# EAGLE design arduino-double (EAGLE 7.3.0)
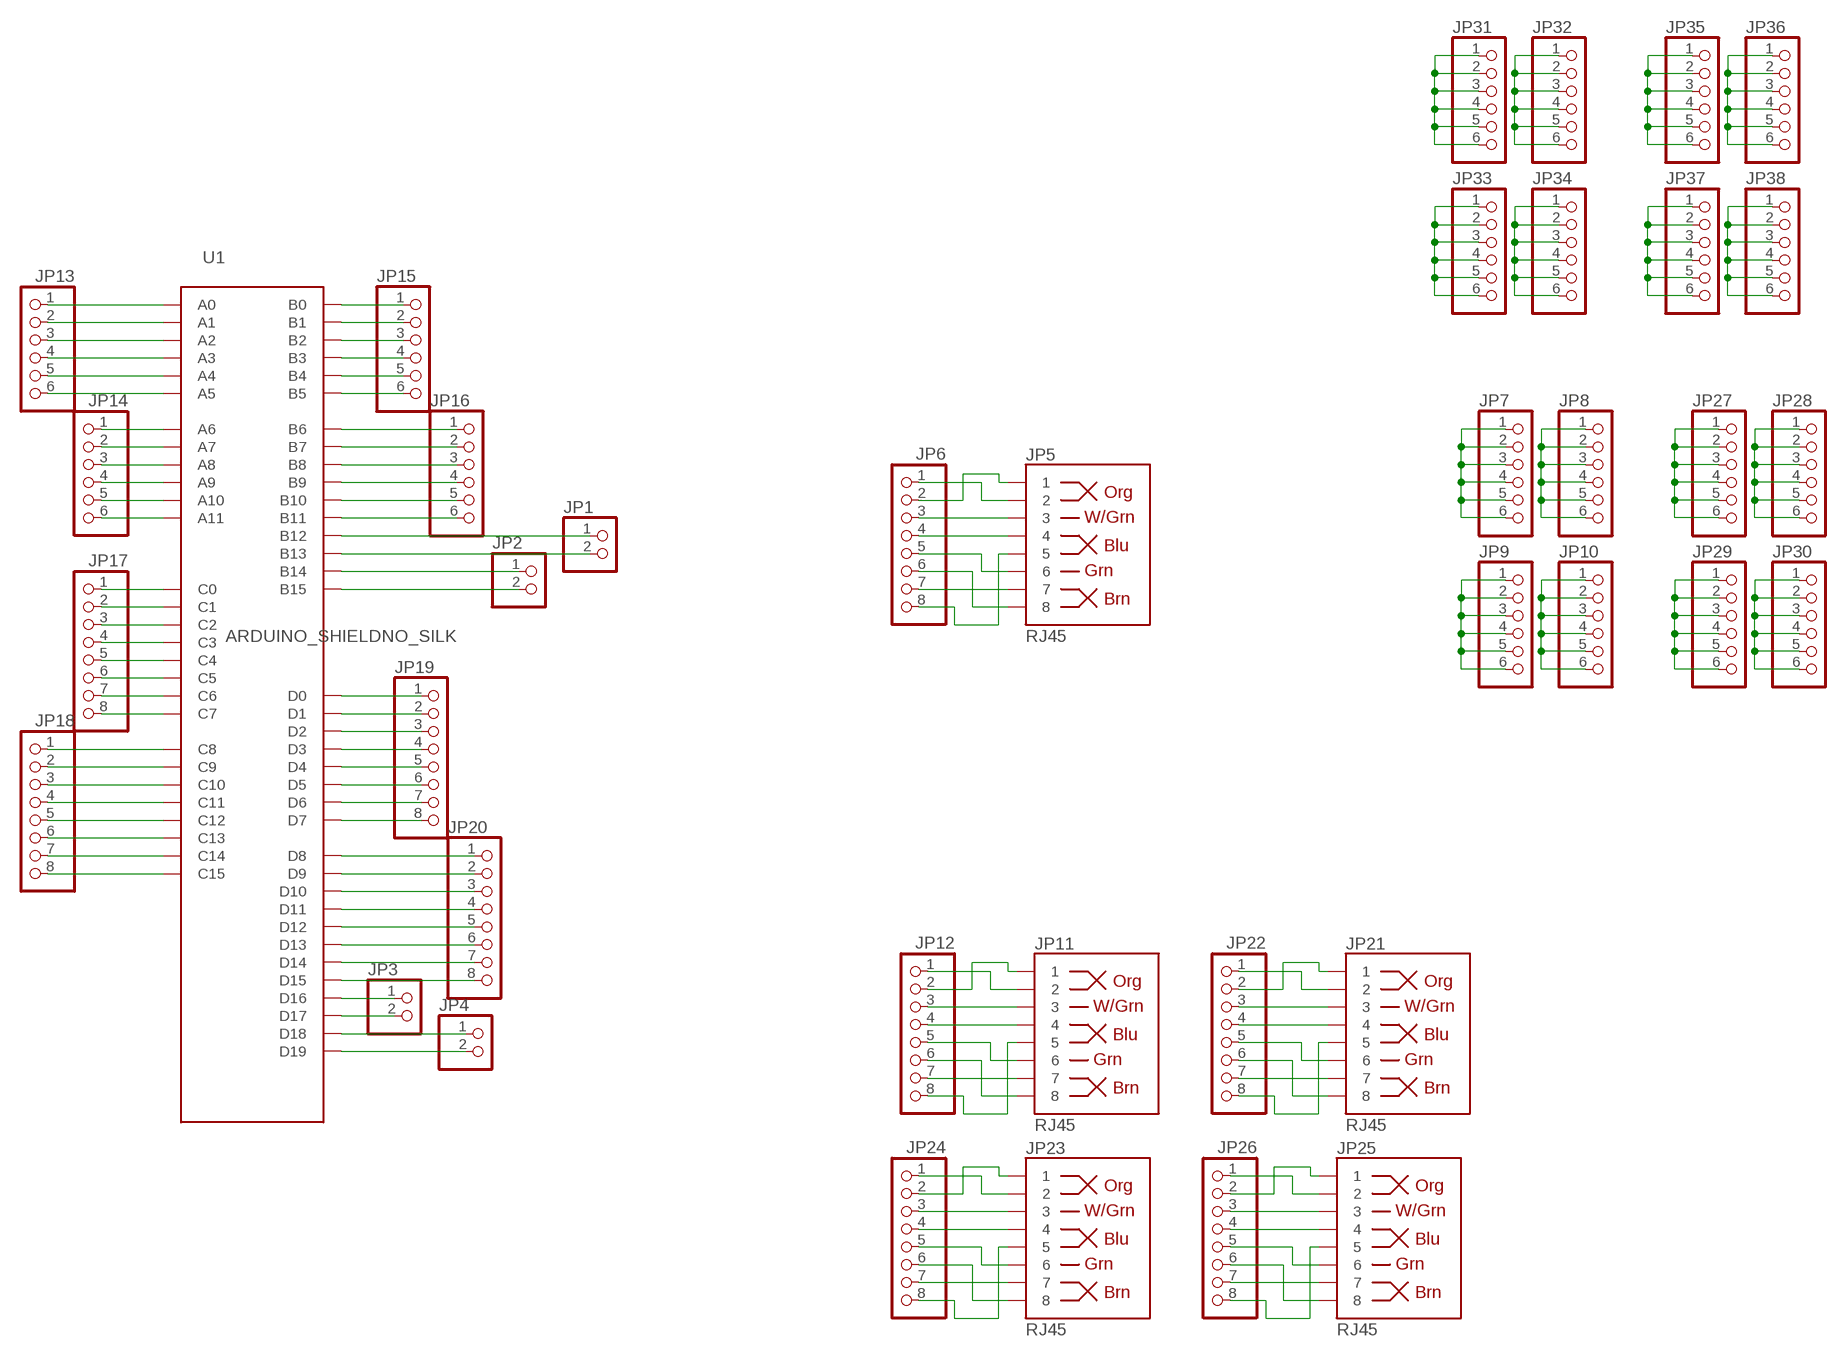
[diagram p0: schematic, sheet 1]

## Parts
JP1  PINHD-1X2  [1X02]
JP2  PINHD-1X2  [1X02]
JP3  PINHD-1X2  [1X02]
JP4  PINHD-1X2  [1X02]
JP5  RJ45  RJ45-8PTH  [RJ45-8]
JP6  PINHD-1X8  [1X08]
JP7  PINHD-1X6  [1X06]
JP8  PINHD-1X6  [1X06]
JP9  PINHD-1X6  [1X06]
JP10  PINHD-1X6  [1X06]
JP11  RJ45  RJ45-8PTH  [RJ45-8]
JP12  PINHD-1X8  [1X08]
JP13  PINHD-1X6  [1X06]
JP14  PINHD-1X6  [1X06]
JP15  PINHD-1X6  [1X06]
JP16  PINHD-1X6  [1X06]
JP17  PINHD-1X8  [1X08]
JP18  PINHD-1X8  [1X08]
JP19  PINHD-1X8  [1X08]
JP20  PINHD-1X8  [1X08]
JP21  RJ45  RJ45-8PTH  [RJ45-8]
JP22  PINHD-1X8  [1X08]
JP23  RJ45  RJ45-8PTH  [RJ45-8]
JP24  PINHD-1X8  [1X08]
JP25  RJ45  RJ45-8PTH  [RJ45-8]
JP26  PINHD-1X8  [1X08]
JP27  PINHD-1X6  [1X06]
JP28  PINHD-1X6  [1X06]
JP29  PINHD-1X6  [1X06]
JP30  PINHD-1X6  [1X06]
JP31  PINHD-1X6  [1X06]
JP32  PINHD-1X6  [1X06]
JP33  PINHD-1X6  [1X06]
JP34  PINHD-1X6  [1X06]
JP35  PINHD-1X6  [1X06]
JP36  PINHD-1X6  [1X06]
JP37  PINHD-1X6  [1X06]
JP38  PINHD-1X6  [1X06]
U1  ARDUINO_SHIELDNO_SILK  [DUEMILANOVE_VIAS]

## Nets
N$1: JP13.1 U1.A0
N$2: JP13.2 U1.A1
N$3: JP13.3 U1.A2
N$4: JP13.4 U1.A3
N$5: JP13.5 U1.A4
N$6: JP13.6 U1.A5
N$7: JP14.1 U1.A6
N$8: JP14.2 U1.A7
N$9: JP14.3 U1.A8
N$10: JP14.4 U1.A9
N$11: JP14.5 U1.A10
N$12: JP14.6 U1.A11
N$13: JP15.1 U1.B0
N$14: JP15.2 U1.B1
N$15: JP15.3 U1.B2
N$16: JP15.4 U1.B3
N$17: JP15.5 U1.B4
N$18: JP15.6 U1.B5
N$19: JP16.1 U1.B6
N$20: JP16.2 U1.B7
N$21: JP16.3 U1.B8
N$22: JP16.4 U1.B9
N$23: JP16.5 U1.B10
N$24: JP16.6 U1.B11
N$25: JP19.1 U1.D0
N$26: JP19.2 U1.D1
N$27: JP19.3 U1.D2
N$28: JP19.4 U1.D3
N$29: JP19.5 U1.D4
N$30: JP19.6 U1.D5
N$31: JP19.7 U1.D6
N$32: JP19.8 U1.D7
N$33: JP20.1 U1.D8
N$34: JP20.2 U1.D9
N$35: JP20.3 U1.D10
N$36: JP20.4 U1.D11
N$37: JP20.5 U1.D12
N$38: JP20.6 U1.D13
N$39: JP20.7 U1.D14
N$40: JP20.8 U1.D15
N$41: JP18.1 U1.C8
N$42: JP18.2 U1.C9
N$43: JP18.3 U1.C10
N$44: JP18.4 U1.C11
N$45: JP18.5 U1.C12
N$46: JP18.6 U1.C13
N$47: JP18.7 U1.C14
N$48: JP18.8 U1.C15
N$49: JP17.8 U1.C7
N$50: JP17.7 U1.C6
N$51: JP17.6 U1.C5
N$52: JP17.5 U1.C4
N$53: JP17.4 U1.C3
N$54: JP17.3 U1.C2
N$55: JP17.2 U1.C1
N$56: JP17.1 U1.C0
N$57: JP1.1 U1.B12
N$58: JP1.2 U1.B13
N$59: JP2.1 U1.B14
N$60: JP2.2 U1.B15
N$61: JP3.1 U1.D16
N$62: JP3.2 U1.D17
N$63: JP4.1 U1.D18
N$64: JP4.2 U1.D19
N$65: JP7.1 JP7.2 JP7.3 JP7.4 JP7.5 JP7.6
N$70: JP8.1 JP8.2 JP8.3 JP8.4 JP8.5 JP8.6
N$71: JP9.1 JP9.2 JP9.3 JP9.4 JP9.5 JP9.6
N$72: JP10.1 JP10.2 JP10.3 JP10.4 JP10.5 JP10.6
N$73: JP5.3 JP6.3
N$74: JP5.4 JP6.4
N$75: JP5.6 JP6.5
N$76: JP5.8 JP6.6
N$77: JP5.1 JP6.2
N$78: JP5.5 JP6.8
N$79: JP5.7 JP6.7
N$80: JP5.2 JP6.1
N$81: JP27.1 JP27.2 JP27.3 JP27.4 JP27.5 JP27.6
N$82: JP28.1 JP28.2 JP28.3 JP28.4 JP28.5 JP28.6
N$83: JP29.1 JP29.2 JP29.3 JP29.4 JP29.5 JP29.6
N$84: JP30.1 JP30.2 JP30.3 JP30.4 JP30.5 JP30.6
N$85: JP31.1 JP31.2 JP31.3 JP31.4 JP31.5 JP31.6
N$86: JP32.1 JP32.2 JP32.3 JP32.4 JP32.5 JP32.6
N$87: JP33.1 JP33.2 JP33.3 JP33.4 JP33.5 JP33.6
N$88: JP34.1 JP34.2 JP34.3 JP34.4 JP34.5 JP34.6
N$89: JP35.1 JP35.2 JP35.3 JP35.4 JP35.5 JP35.6
N$90: JP36.1 JP36.2 JP36.3 JP36.4 JP36.5 JP36.6
N$91: JP37.1 JP37.2 JP37.3 JP37.4 JP37.5 JP37.6
N$92: JP38.1 JP38.2 JP38.3 JP38.4 JP38.5 JP38.6
N$97: JP11.3 JP12.3
N$98: JP11.4 JP12.4
N$99: JP11.6 JP12.5
N$100: JP11.8 JP12.6
N$101: JP11.1 JP12.2
N$102: JP11.5 JP12.8
N$103: JP11.7 JP12.7
N$104: JP11.2 JP12.1
N$106: JP21.3 JP22.3
N$107: JP21.4 JP22.4
N$108: JP21.6 JP22.5
N$109: JP21.8 JP22.6
N$110: JP21.1 JP22.2
N$111: JP21.5 JP22.8
N$112: JP21.7 JP22.7
N$113: JP21.2 JP22.1
N$114: JP23.3 JP24.3
N$115: JP23.4 JP24.4
N$116: JP23.6 JP24.5
N$117: JP23.8 JP24.6
N$118: JP23.1 JP24.2
N$119: JP23.5 JP24.8
N$120: JP23.7 JP24.7
N$121: JP23.2 JP24.1
N$122: JP25.3 JP26.3
N$123: JP25.4 JP26.4
N$124: JP25.6 JP26.5
N$125: JP25.8 JP26.6
N$126: JP25.1 JP26.2
N$127: JP25.5 JP26.8
N$128: JP25.7 JP26.7
N$129: JP25.2 JP26.1

## Library data of the parts
JP1-JP4 = pinhead:PINHD-1X2: PIN HEADER
JP5 JP11 JP21 JP23 JP25 = dbg-misc:RJ45-8: RJ45 Jack Simple RJ45, 8-pin connection - connector for common Cat5, Cat5e, and Cat6 Ethernet cables. Footprint not yet proven in production. Connector sku is PRT-00643; Breakout PCB sku is BOB-00716.; PROD_ID: CONN-08506
JP6 JP12 JP17-JP20 JP22 JP24 JP26 = pinhead:PINHD-1X8: PIN HEADER
JP7-JP10 JP13-JP16 JP27-JP38 = pinhead:PINHD-1X6: PIN HEADER
U1 = dbg-misc:ARDUINO_SHIELD: Arduino shield footprint

## Board
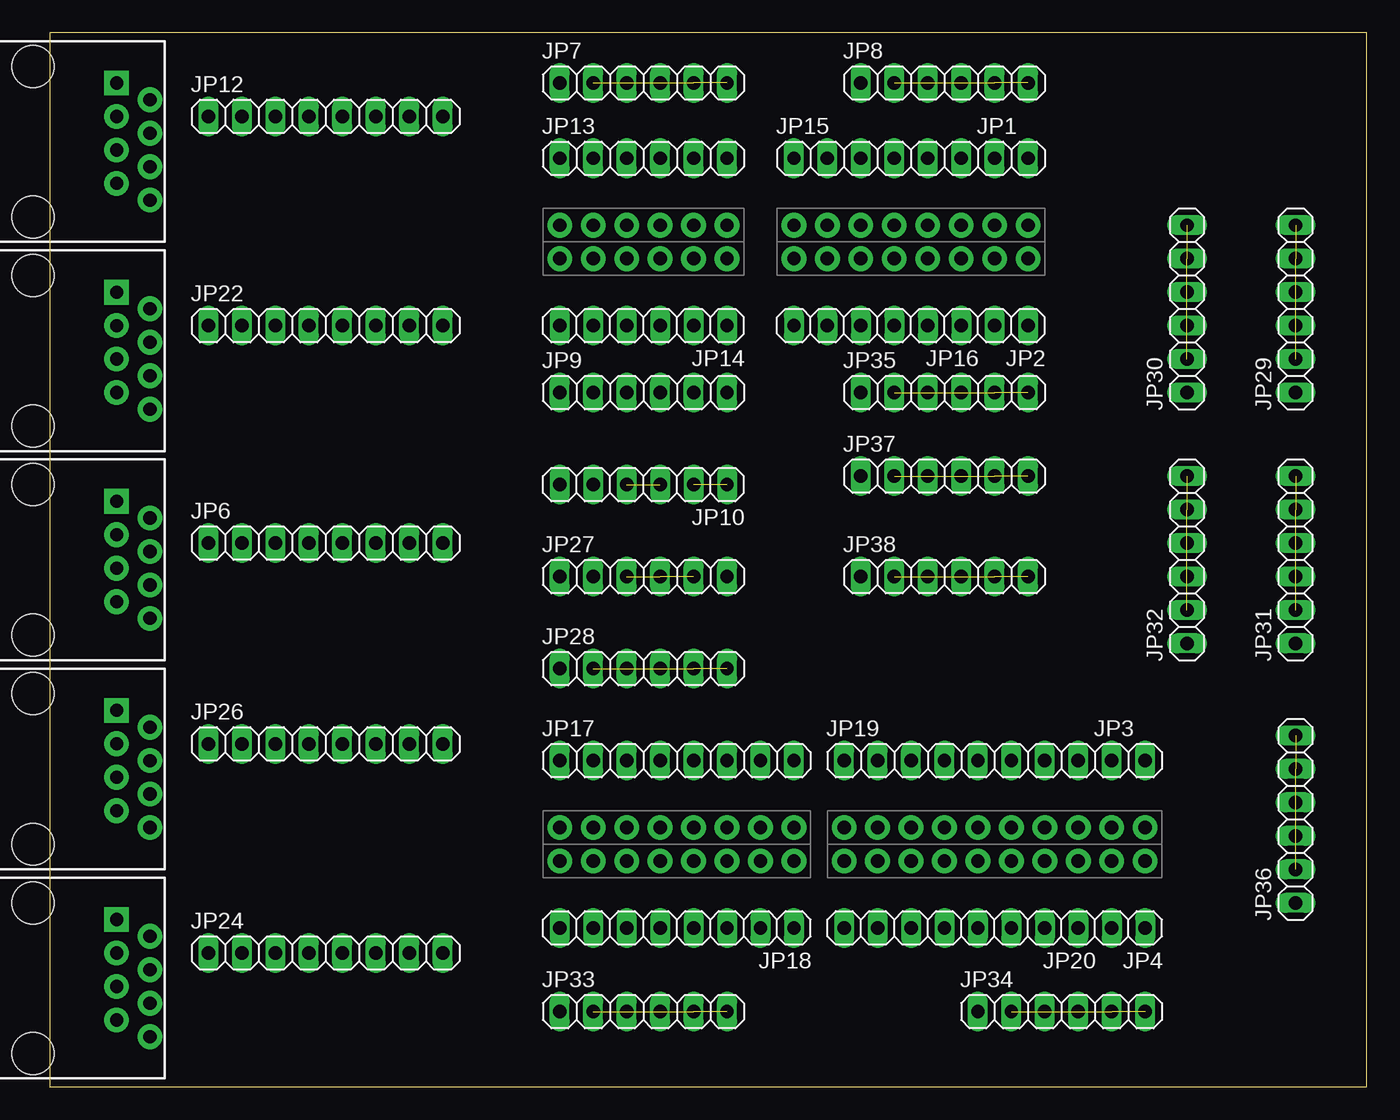
[diagram p1: board, top side]
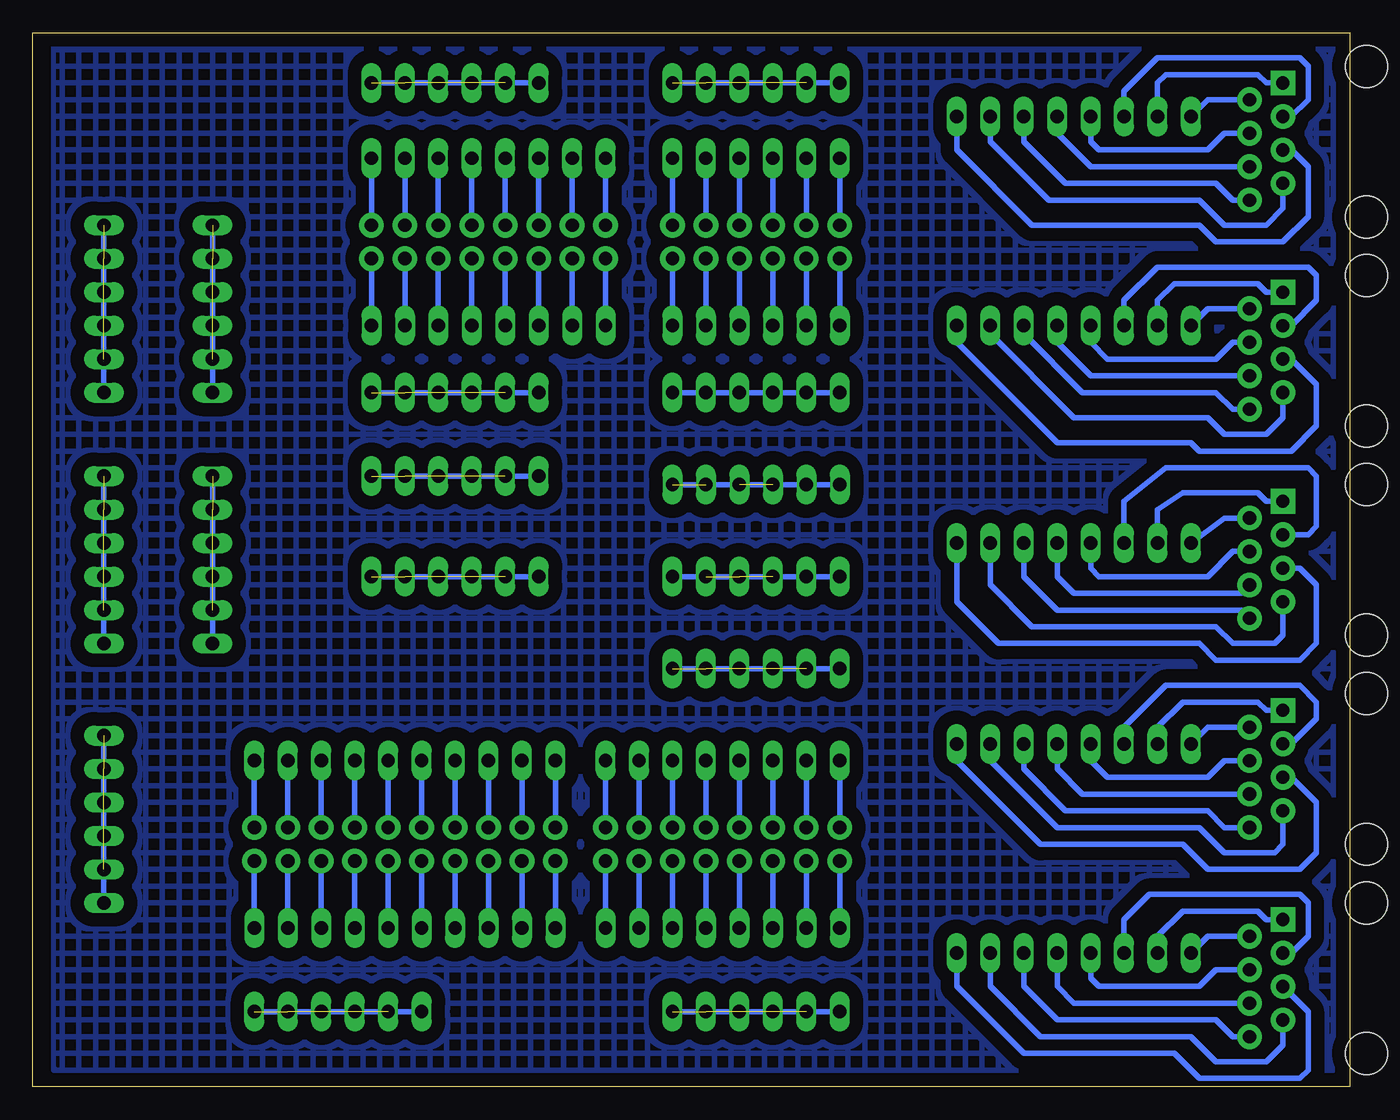
[diagram p2: board, bottom side, seen from below]

Size 100 x 80 mm. Coordinates in mm from the lower left corner, seen from the top.
Outline: 0,0 100,0 100,80 0,80 0,0
Copper layers (1*16): Top 0.035mm / dielectric 1.5mm / Bottom 0.035mm
Design rules "default": minimum track width 10mil, minimum drill 24mil, track to track 8mil, track to pad 8mil, pad to pad 8mil, via to via 8mil, smd to smd 8mil, copper to edge 40mil, drill to drill 8mil, minimum pad ring 10mil, minimum via ring 8mil, stop-mask expansion 4mil, vias tented up to drill 0mil, thermal gap 10mil

### Footprints (pad centres in the part's own frame; a part is rotated, then mirrored left to right if it is on the bottom)
1X02 = drill 1.016 long: 1 -1.27,0; 2 1.27,0
RJ45-8 = drill 1 pad 1.88 square: 1 -4.445,6.35 | drill 1 pad 1.88: 2 -3.175,8.89; 3 -1.905,6.35; 4 -0.635,8.89; 5 0.635,6.35; 6 1.905,8.89; 7 3.175,6.35; 8 4.445,8.89 | hole 3.2: -5.715,0; 5.715,0
1X08 = drill 1.016 long: 1 -8.89,0; 2 -6.35,0; 3 -3.81,0; 4 -1.27,0; 5 1.27,0; 6 3.81,0; 7 6.35,0; 8 8.89,0
1X06 = drill 1.016 long: 1 -6.35,0; 2 -3.81,0; 3 -1.27,0; 4 1.27,0; 5 3.81,0; 6 6.35,0
DUEMILANOVE_VIAS = drill 1.016 pad 1.88: A0 50.8,41.91; A1 50.8,39.37; A2 50.8,36.83; A3 50.8,34.29; A4 50.8,31.75; A5 50.8,29.21; A6 48.26,29.21; A7 48.26,31.75; A8 48.26,34.29; A9 48.26,36.83; A10 48.26,39.37; A11 48.26,41.91; B0 50.8,24.13; B1 50.8,21.59; B2 50.8,19.05; B3 50.8,16.51; B4 50.8,13.97; B5 50.8,11.43; B6 48.26,11.43; B7 48.26,13.97; B8 48.26,16.51; B9 48.26,19.05; B10 48.26,21.59; B11 48.26,24.13; B12 50.8,8.89; B13 50.8,6.35; B14 48.26,6.35; B15 48.26,8.89; C0 5.08,41.91; C1 5.08,39.37; C2 5.08,36.83; C3 5.08,34.29; C4 5.08,31.75; C5 5.08,29.21; C6 5.08,26.67; C7 5.08,24.13; C8 2.54,24.13; C9 2.54,26.67; C10 2.54,29.21; C11 2.54,31.75; C12 2.54,34.29; C13 2.54,36.83; C14 2.54,39.37; C15 2.54,41.91; D0 5.08,20.32; D1 5.08,17.78; D2 5.08,15.24; D3 5.08,12.7; D4 5.08,10.16; D5 5.08,7.62; D6 5.08,5.08; D7 5.08,2.54; D8 2.54,2.54; D9 2.54,5.08; D10 2.54,7.62; D11 2.54,10.16; D12 2.54,12.7; D13 2.54,15.24; D14 2.54,17.78; D15 2.54,20.32; D16 5.08,0; D17 5.08,-2.54; D18 2.54,-2.54; D19 2.54,0

### Placement (x,y rotation side)
JP1  73.03,70.48 0 top
JP2  73.03,57.78 180 top
JP3  81.92,24.77 0 top
JP4  81.92,12.06 180 top
JP5  -1.27,40.01 270 top
JP6  20.95,41.27 0 top
JP7  45.09,76.2 0 top
JP8  67.94,76.2 0 top
JP9  45.09,52.7 0 top
JP10  45.09,45.72 180 top
JP11  -1.27,71.75 270 top
JP12  20.95,73.66 0 top
JP13  45.09,70.48 0 top
JP14  45.09,57.78 180 top
JP15  62.87,70.48 0 top
JP16  62.87,57.78 180 top
JP17  47.62,24.77 0 top
JP18  47.62,12.06 180 top
JP19  69.22,24.77 0 top
JP20  69.22,12.06 180 top
JP21  -1.27,55.88 270 top
JP22  20.95,57.78 0 top
JP23  -1.27,8.26 270 top
JP24  20.95,10.16 0 top
JP25  -1.27,24.13 270 top
JP26  20.95,26.04 0 top
JP27  45.09,38.73 0 top
JP28  45.09,31.75 0 top
JP29  94.61,59.05 90 top
JP30  86.36,59.05 90 top
JP31  94.61,40.01 90 top
JP32  86.36,40.01 90 top
JP33  45.09,5.71 0 top
JP34  76.83,5.71 0 top
JP35  67.94,52.7 0 top
JP36  94.61,20.32 90 top
JP37  67.94,46.35 0 top
JP38  67.94,38.73 0 top
U1  80.64,14.61 90 top

### Tracks (layer width: path | path; a pad name or v marks a point on that pad's centre or on a via)
N$1
  Bottom 0.406: JP13.1 U1.A0
N$2
  Bottom 0.406: JP13.2 U1.A1
N$3
  Bottom 0.406: JP13.3 U1.A2
N$4
  Bottom 0.406: JP13.4 U1.A3
N$5
  Bottom 0.406: JP13.5 U1.A4
N$6
  Bottom 0.406: JP13.6 U1.A5
N$7
  Bottom 0.406: U1.A6 JP14.1
N$8
  Bottom 0.406: U1.A7 JP14.2
N$9
  Bottom 0.406: U1.A8 JP14.3
N$10
  Bottom 0.406: U1.A9 JP14.4
N$11
  Bottom 0.406: U1.A10 JP14.5
N$12
  Bottom 0.406: U1.A11 JP14.6
N$13
  Bottom 0.406: JP15.1 U1.B0
N$14
  Bottom 0.406: JP15.2 U1.B1
N$15
  Bottom 0.406: JP15.3 U1.B2
N$16
  Bottom 0.406: JP15.4 U1.B3
N$17
  Bottom 0.406: JP15.5 U1.B4
N$18
  Bottom 0.406: JP15.6 U1.B5
N$19
  Bottom 0.406: U1.B6 JP16.1
N$20
  Bottom 0.406: U1.B7 JP16.2
N$21
  Bottom 0.406: U1.B8 JP16.3
N$22
  Bottom 0.406: U1.B9 JP16.4
N$23
  Bottom 0.406: U1.B10 JP16.5
N$24
  Bottom 0.406: U1.B11 JP16.6
N$25
  Bottom 0.406: JP19.1 U1.D0
N$26
  Bottom 0.406: JP19.2 U1.D1
N$27
  Bottom 0.406: JP19.3 U1.D2
N$28
  Bottom 0.406: JP19.4 U1.D3
N$29
  Bottom 0.406: JP19.5 U1.D4
N$30
  Bottom 0.406: JP19.6 U1.D5
N$31
  Bottom 0.406: JP19.7 U1.D6
N$32
  Bottom 0.406: JP19.8 U1.D7
N$33
  Bottom 0.406: U1.D8 JP20.1
N$34
  Bottom 0.406: U1.D9 JP20.2
N$35
  Bottom 0.406: U1.D10 JP20.3
N$36
  Bottom 0.406: U1.D11 JP20.4
N$37
  Bottom 0.406: U1.D12 JP20.5
N$38
  Bottom 0.406: U1.D13 JP20.6
N$39
  Bottom 0.406: U1.D14 JP20.7
N$40
  Bottom 0.406: U1.D15 JP20.8
N$41
  Bottom 0.406: U1.C8 JP18.1
N$42
  Bottom 0.406: U1.C9 JP18.2
N$43
  Bottom 0.406: U1.C10 JP18.3
N$44
  Bottom 0.406: U1.C11 JP18.4
N$45
  Bottom 0.406: U1.C12 JP18.5
N$46
  Bottom 0.406: U1.C13 JP18.6
N$47
  Bottom 0.406: U1.C14 JP18.7
N$48
  Bottom 0.406: U1.C15 JP18.8
N$49
  Bottom 0.406: JP17.8 U1.C7
N$50
  Bottom 0.406: JP17.7 U1.C6
N$51
  Bottom 0.406: JP17.6 U1.C5
N$52
  Bottom 0.406: JP17.5 U1.C4
N$53
  Bottom 0.406: JP17.4 U1.C3
N$54
  Bottom 0.406: JP17.3 U1.C2
N$55
  Bottom 0.406: JP17.2 U1.C1
N$56
  Bottom 0.406: JP17.1 U1.C0
N$57
  Bottom 0.406: JP1.1 U1.B12
N$58
  Bottom 0.406: JP1.2 U1.B13
N$59
  Bottom 0.406: U1.B14 JP2.1
N$60
  Bottom 0.406: U1.B15 JP2.2
N$61
  Bottom 0.406: JP3.1 U1.D16
N$62
  Bottom 0.406: JP3.2 U1.D17
N$63
  Bottom 0.406: U1.D18 JP4.1
N$64
  Bottom 0.406: U1.D19 JP4.2
N$65  (4 unrouted)
  Bottom 0.406: JP7.1 JP7.6
N$66
  pour Bottom (isolate 1.016, hatched): 1.27,79.38 1.27,1.27 98.42,1.27 98.42,79.38
N$70  (4 unrouted)
  Bottom 0.406: JP8.1 JP8.6
N$71
  Bottom 0.406: JP9.1 JP9.2 JP9.3 JP9.4 JP9.5 JP9.6
N$72  (2 unrouted)
  Bottom 0.406: JP10.6 JP10.5 JP10.3 JP10.1
N$73
  Bottom 0.406: JP5.3 3.17,41.91 2.54,42.55 2.54,46.35 3.17,46.99 13.97,46.99 17.14,44.45 JP6.3
N$74
  Bottom 0.406: JP5.4 8.89,40.64 10.79,38.73 19.05,38.73 19.68,39.37 JP6.4
N$75
  Bottom 0.406: JP6.5 22.23,38.73 20.95,37.47 8.26,37.47 JP5.6
N$76
  Bottom 0.406: JP6.6 24.77,38.73 22.23,36.2 8.26,36.2 JP5.8
N$77
  Bottom 0.406: JP5.1 6.35,44.45 6.99,45.09 12.7,45.09 14.61,43.81 JP6.2
N$78
  Bottom 0.406: JP5.5 3.81,39.37 2.54,38.1 2.54,33.66 3.81,32.38 10.16,32.38 11.43,33.66 26.67,33.66 29.84,36.83 JP6.8
N$79
  Bottom 0.406: JP6.7 27.3,38.1 24.13,34.92 10.16,34.92 8.89,33.66 5.71,33.66 5.08,34.29 JP5.7
N$80
  Bottom 0.406: JP5.2 9.53,43.18 JP6.1
N$81  (2 unrouted)
  Bottom 0.406: JP27.1 JP27.2 JP27.5 50.8,38.73 JP27.6
N$82  (4 unrouted)
  Bottom 0.406: JP28.1 JP28.6
N$83  (4 unrouted)
  Bottom 0.406: JP29.6 JP29.1
N$84  (4 unrouted)
  Bottom 0.406: JP30.6 JP30.1
N$85  (4 unrouted)
  Bottom 0.406: JP31.6 JP31.1
N$86  (4 unrouted)
  Bottom 0.406: JP32.6 JP32.1
N$87  (4 unrouted)
  Bottom 0.406: JP33.1 JP33.6
N$88  (4 unrouted)
  Bottom 0.406: JP34.1 JP34.6
N$89  (4 unrouted)
  Bottom 0.406: JP35.1 JP35.6
N$90  (4 unrouted)
  Bottom 0.406: JP36.6 JP36.1
N$91  (4 unrouted)
  Bottom 0.406: JP37.1 JP37.6
N$92  (4 unrouted)
  Bottom 0.406: JP38.1 JP38.6
N$97
  Bottom 0.406: JP11.3 4.45,73.66 3.17,74.93 3.17,77.47 3.81,78.11 14.61,78.11 17.14,75.56 JP12.3
N$98
  Bottom 0.406: JP11.4 9.53,72.39 10.79,71.12 19.05,71.12 19.68,71.75 JP12.4
N$99
  Bottom 0.406: JP12.5 22.23,72.39 19.68,69.85 JP11.6
N$100
  Bottom 0.406: JP12.6 24.77,71.75 21.59,68.58 10.16,68.58 8.89,67.31 JP11.8
N$101
  Bottom 0.406: JP11.1 6.35,76.2 6.99,76.83 13.97,76.83 14.61,76.2 JP12.2
N$102
  Bottom 0.406: JP11.5 4.45,71.12 3.17,69.85 3.17,66.04 5.08,64.14 10.16,64.14 11.43,65.41 24.13,65.41 29.84,71.12 JP12.8
N$103
  Bottom 0.406: JP11.7 5.08,66.67 6.35,65.41 9.53,65.41 11.43,67.31 22.86,67.31 27.3,71.75 JP12.7
N$104
  Bottom 0.406: JP11.2 10.79,74.93 JP12.1
N$106
  Bottom 0.406: JP21.3 4.45,57.78 2.54,59.69 2.54,61.59 3.17,62.23 14.61,62.23 17.14,59.69 JP22.3
N$107
  Bottom 0.406: JP22.4 19.68,56.52 18.41,55.24 10.16,55.24 8.89,56.52 JP21.4
N$108
  Bottom 0.406: JP22.5 22.23,56.52 19.68,53.98 JP21.6
N$109
  Bottom 0.406: JP22.6 24.77,57.15 20.32,52.7 10.16,52.7 8.89,51.44 JP21.8
N$110
  Bottom 0.406: JP21.1 6.35,60.33 6.99,60.96 13.34,60.96 14.61,59.69 JP22.2
N$111
  Bottom 0.406: JP21.5 4.45,55.24 2.54,53.34 2.54,50.16 4.45,48.26 11.43,48.26 12.06,48.9 22.23,48.9 29.84,56.52 JP22.8
N$112
  Bottom 0.406: JP22.7 27.3,57.15 20.95,50.8 10.79,50.8 9.53,49.53 6.35,49.53 5.08,50.8 JP21.7
N$113
  Bottom 0.406: JP21.2 10.79,59.05 JP22.1
N$114
  Bottom 0.406: JP23.3 4.45,10.16 3.17,11.43 3.17,13.97 3.81,14.61 15.24,14.61 17.14,12.7 JP24.3
N$115
  Bottom 0.406: JP23.4 10.16,8.89 11.43,7.62 19.05,7.62 19.68,8.26 JP24.4
N$116
  Bottom 0.406: JP23.6 20.95,6.35 22.23,7.62 JP24.5
N$117
  Bottom 0.406: JP23.8 8.89,3.81 10.16,5.08 22.23,5.08 24.77,7.62 JP24.6
N$118
  Bottom 0.406: JP23.1 6.35,12.7 6.99,13.34 12.7,13.34 14.61,11.43 JP24.2
N$119
  Bottom 0.406: JP23.5 3.17,5.71 3.17,1.27 3.81,0.64 11.43,0.64 13.34,2.54 24.77,2.54 29.84,7.62 JP24.8
N$120
  Bottom 0.406: JP23.7 5.08,3.17 6.35,1.91 10.16,1.91 12.06,3.81 23.5,3.81 27.3,7.62 JP24.7
N$121
  Bottom 0.406: JP23.2 10.79,11.43 JP24.1
N$122
  Bottom 0.406: JP25.3 4.45,26.04 2.54,27.94 2.54,29.21 3.81,30.48 13.97,30.48 17.14,27.3 JP26.3
N$123
  Bottom 0.406: JP25.4 9.53,24.77 10.79,23.5 18.41,23.5 19.68,24.77 JP26.4
N$124
  Bottom 0.406: JP25.6 20.32,22.23 22.23,24.13 JP26.5
N$125
  Bottom 0.406: JP25.8 9.53,19.68 10.79,20.95 21.59,20.95 24.77,24.13 JP26.6
N$126
  Bottom 0.406: JP25.1 6.35,28.57 6.99,29.21 12.7,29.21 14.61,27.3 JP26.2
N$127
  Bottom 0.406: JP25.5 4.45,23.5 2.54,21.59 2.54,17.78 3.81,16.51 10.79,16.51 12.7,18.41 23.5,18.41 29.84,24.77 JP26.8
N$128
  Bottom 0.406: JP26.7 27.3,24.77 22.23,19.68 11.43,19.68 9.53,17.78 5.71,17.78 5.08,18.41 JP25.7
N$129
  Bottom 0.406: JP25.2 10.79,27.3 JP26.1